# EAGLE schematic Schematic (EAGLE 9.7.0)
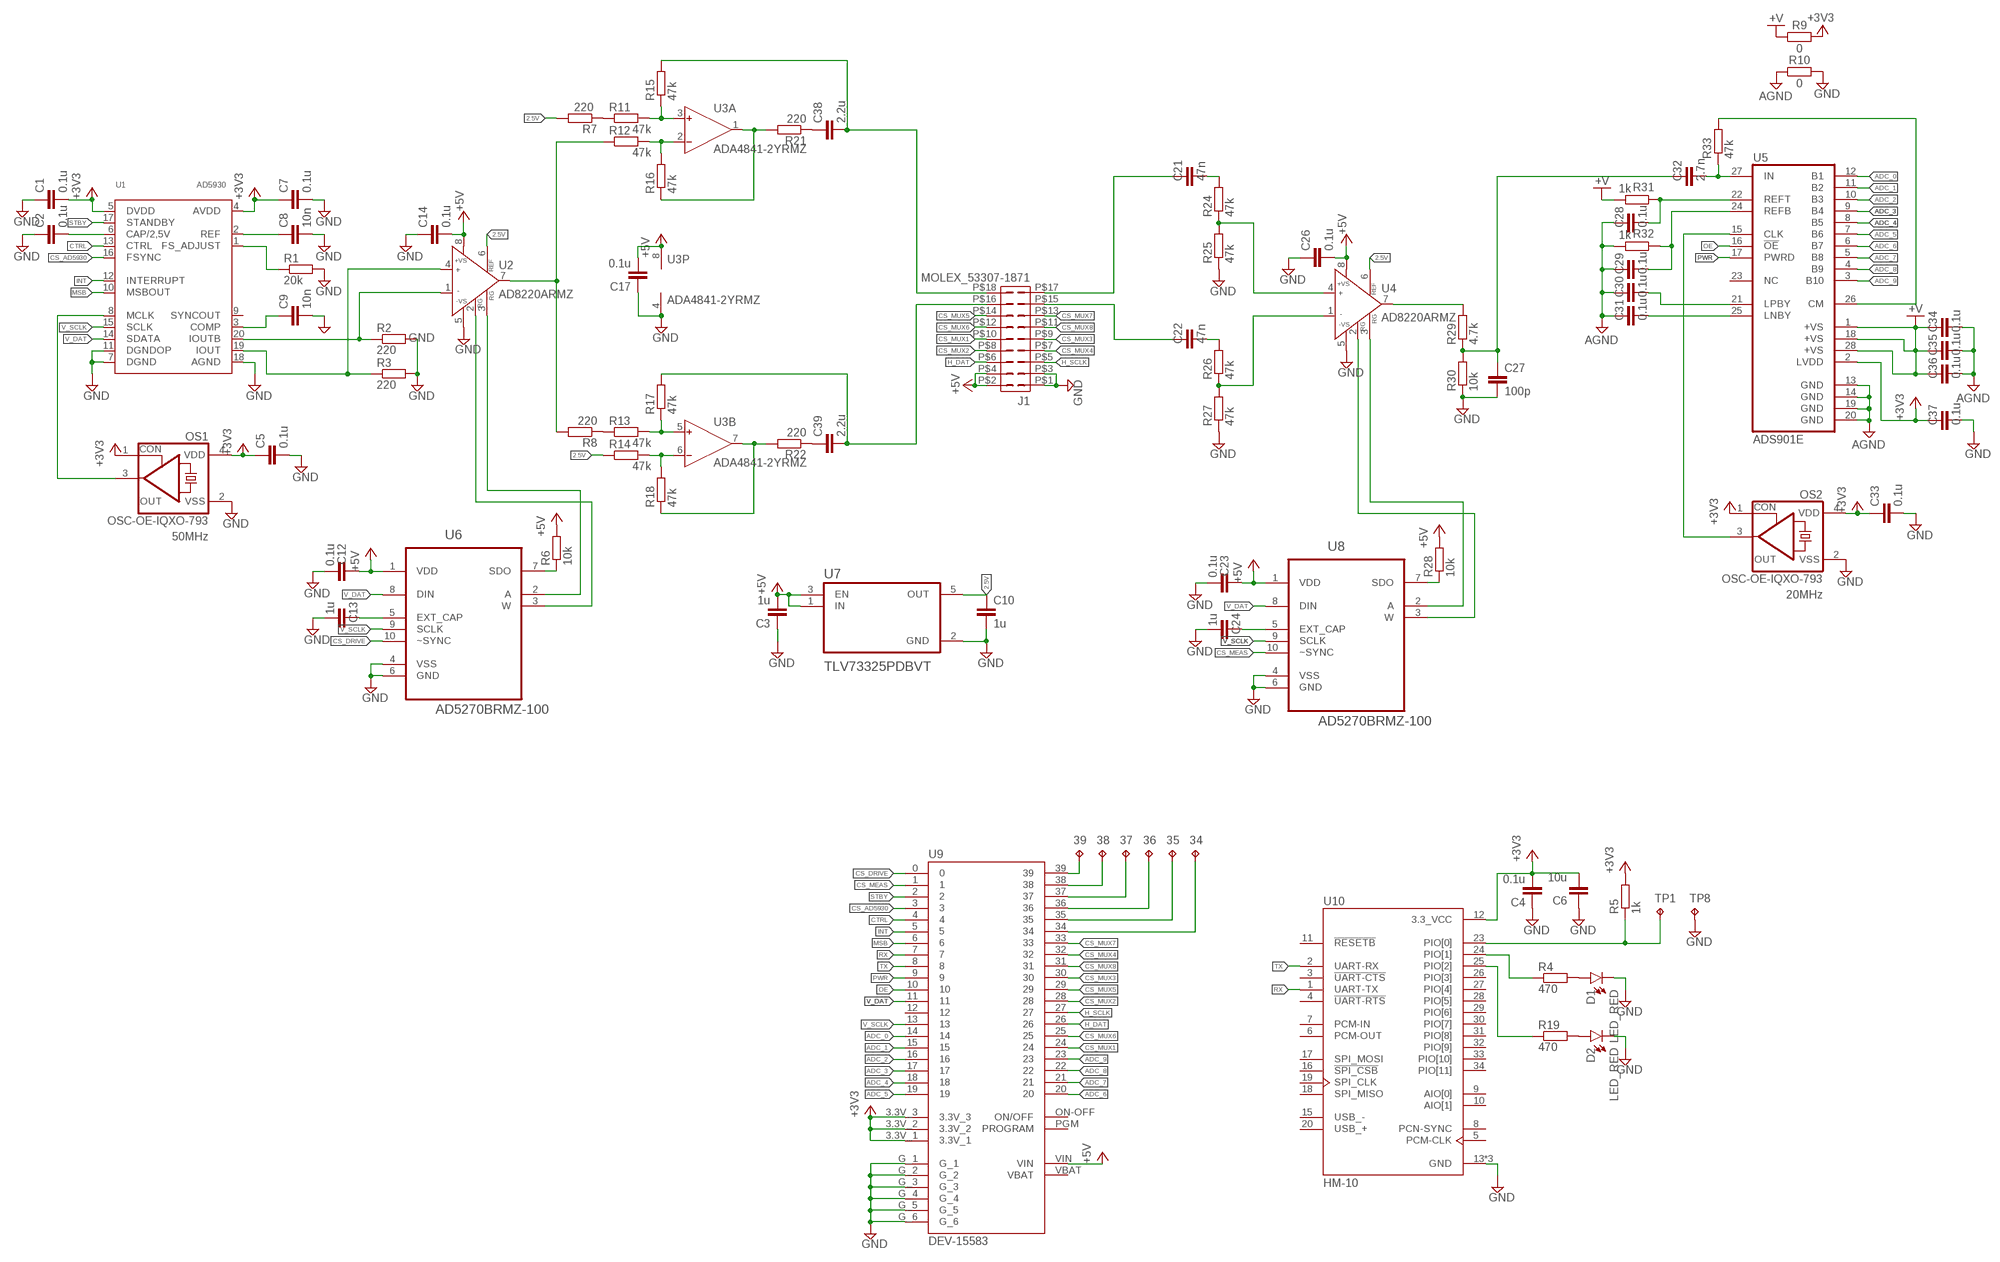
[diagram p0: schematic, sheet 1]

## Parts
34  TPTP13R  [TP13R]
35  TPTP13R  [TP13R]
36  TPTP13R  [TP13R]
37  TPTP13R  [TP13R]
38  TPTP13R  [TP13R]
39  TPTP13R  [TP13R]
C1  0.1u  C-EUC0603  [C0603]
C2  0.1u  C-EUC0603  [C0603]
C3  1u  C-EUC0603  [C0603]
C4  0.1u  C-EUC0603  [C0603]
C5  0.1u  C-EUC0603  [C0603]
C6  10u  C_CHIP-0805(2012-METRIC)  [CAPC2012X110]
C7  0.1u  C-EUC0603  [C0603]
C8  10n  C-EUC0603  [C0603]
C9  10n  C-EUC0603  [C0603]
C10  1u  C-EUC0603  [C0603]
C12  0.1u  C-EUC0603  [C0603]
C13  1u  C-EUC0603  [C0603]
C14  0.1u  C-EUC0603  [C0603]
C17  0.1u  C-EUC0603  [C0603]
C21  47n  C-EUC0603  [C0603]
C22  47n  C-EUC0603  [C0603]
C23  0.1u  C-EUC0603  [C0603]
C24  1u  C-EUC0603  [C0603]
C26  0.1u  C-EUC0603  [C0603]
C27  100p  C-EUC0603  [C0603]
C28  0.1u  C_CHIP-0402(1005-METRIC)  [CAPC1005X60]
C29  0.1u  C_CHIP-0402(1005-METRIC)  [CAPC1005X60]
C30  0.1u  C_CHIP-0402(1005-METRIC)  [CAPC1005X60]
C31  0.1u  C_CHIP-0402(1005-METRIC)  [CAPC1005X60]
C32  2.7n  C_CHIP-0402(1005-METRIC)  [CAPC1005X60]
C33  0.1u  C_CHIP-0402(1005-METRIC)  [CAPC1005X60]
C34  0.1u  C_CHIP-0402(1005-METRIC)  [CAPC1005X60]
C35  0.1u  C_CHIP-0402(1005-METRIC)  [CAPC1005X60]
C36  0.1u  C_CHIP-0402(1005-METRIC)  [CAPC1005X60]
C37  0.1u  C_CHIP-0402(1005-METRIC)  [CAPC1005X60]
C38  2.2u  C-EUC0603  [C0603]
C39  2.2u  C-EUC0603  [C0603]
D1  LED_RED  CHIP-ROUND-R_0603  [LEDC1608X65N_RND-R]
D2  LED_RED  CHIP-ROUND-R_0603  [LEDC1608X65N_RND-R]
J1  MOLEX_53307-1871  [MOLEX_53307-1871]
OS1  OSC-OE-IQXO-793  [2.5X2-4-PAD]
OS2  OSC-OE-IQXO-793  [2.5X2-4-PAD]
R1  20k  R-EU_R0603  [R0603]
R2  220  R-EU_R0603  [R0603]
R3  220  R-EU_R0603  [R0603]
R4  470  R-EU_R0603  [R0603]
R5  1k  R-EU_R0603  [R0603]
R6  10k  R-EU_R0603  [R0603]
R7  220  R-EU_R0603  [R0603]
R8  220  R-EU_R0603  [R0603]
R9  0  R_CHIP-0603(1608-METRIC)  [RESC1608X60]
R10  0  R_CHIP-0603(1608-METRIC)  [RESC1608X60]
R11  47k  R-EU_R0603  [R0603]
R12  47k  R-EU_R0603  [R0603]
R13  47k  R-EU_R0603  [R0603]
R14  47k  R-EU_R0603  [R0603]
R15  47k  R-EU_R0603  [R0603]
R16  47k  R-EU_R0603  [R0603]
R17  47k  R-EU_R0603  [R0603]
R18  47k  R-EU_R0603  [R0603]
R19  470  R-EU_R0603  [R0603]
R21  220  R-EU_R0603  [R0603]
R22  220  R-EU_R0603  [R0603]
R24  47k  R-EU_R0603  [R0603]
R25  47k  R-EU_R0603  [R0603]
R26  47k  R-EU_R0603  [R0603]
R27  47k  R-EU_R0603  [R0603]
R28  10k  R-EU_R0603  [R0603]
R29  4.7k  R-EU_R0603  [R0603]
R30  10k  R-EU_R0603  [R0603]
R31  1k  R_CHIP-0402(1005-METRIC)  [RESC1005X40]
R32  1k  R_CHIP-0402(1005-METRIC)  [RESC1005X40]
R33  47k  R_CHIP-0402(1005-METRIC)  [RESC1005X40]
TP1  TPTP20SQ  [TP20SQ]
TP8  TPTP20SQ  [TP20SQ]
U1  AD5930  [TSSOP20]
U2  AD8220ARMZ  [MSOP8]
U3  ADA4841-2YRMZ  [MSOP8]
U4  AD8220ARMZ  [MSOP8]
U5  ADS901E  [SSOP28BU]
U6  AD5270BRMZ-100  [SOP50P490X110-10N]
U7  TLV73325PDBVT  [SOT95P280X145-5N]
U8  AD5270BRMZ-100  [SOP50P490X110-10N]
U9  DEV-15583  [MODULE_DEV-15583]
U10  HM-10  [HM-10]

## Nets
2.5V: C10.1 R7.2 R14.1 U2.6(REF) U4.6(REF) U7.5(OUT)
+3V3 [Pour]: C1.2 C4.2 C5.1 C6.2 C7.1 C33.1 C37.1 OS1.1(CON) OS1.4(VDD) OS2.1(CON) OS2.4(VDD) R5.2 R9.2 U1.4(AVDD) U1.5(DVDD) U5.2(LVDD) U9.3.3V_1 U9.3.3V_2 U9.3.3V_3 U10.12(3.3_VCC)
+5V [Pour]: C3.2 C12.1 C14.2 C17.2 C23.1 C26.2 J1.P$2 J1.P$4 R6.2 R28.2 U2.8(+VS) U3.8(P:V+) U4.8(+VS) U6.1(VDD) U7.1(IN) U7.3(EN) U8.1(VDD) U9.VIN
+V: C34.1 C35.1 C36.1 R9.1 R31.2 U5.1(+VS) U5.18(+VS) U5.28(+VS)
ADC_0: U5.12(B1) U9.14
ADC_1: U5.11(B2) U9.15
ADC_2: U5.10(B3) U9.16
ADC_3: U5.9(B4) U9.17
ADC_4: U5.8(B5) U9.18
ADC_5: U5.7(B6) U9.19
ADC_6: U5.6(B7) U9.20
ADC_7: U5.5(B8) U9.21
ADC_8: U5.4(B9) U9.22
ADC_9: U5.3(B10) U9.23
AGND: C28.1 C29.1 C30.1 C31.1 C34.2 C35.2 C36.2 R10.1 R32.2 U5.13(GND) U5.14(GND) U5.19(GND) U5.20(GND)
CS_AD5930: U1.16(FSYNC) U9.3
CS_DRIVE: U6.10(~SYNC) U9.0
CS_MEAS: U8.10(~SYNC) U9.1
CS_MUX1: J1.P$10 U9.24
CS_MUX2: J1.P$8 U9.28
CS_MUX3: J1.P$9 U9.30
CS_MUX4: J1.P$7 U9.32
CS_MUX5: J1.P$14 U9.29
CS_MUX6: J1.P$12 U9.25
CS_MUX7: J1.P$13 U9.33
CS_MUX8: J1.P$11 U9.31
CTRL: U1.13(CTRL) U9.4
GND [Pour]: C1.1 C2.1 C3.1 C4.1 C5.2 C6.1 C7.2 C8.2 C9.2 C10.2 C12.2 C13.2 C14.1 C17.1 C23.2 C24.2 C26.1 C27.2 C33.2 C37.2 D1.C D2.C J1.P$1 J1.P$3 OS1.2(VSS) OS2.2(VSS) R1.2 R2.2 R3.2 R10.2 R25.1 R27.1 R30.1 TP8.TP U1.7(DGND) U1.11(DGNDOP) U1.18(AGND) U2.5(-VS) U3.4(P:V-) U4.5(-VS) U6.4(VSS) U6.6(GND) U7.2(GND) U8.4(VSS) U8.6(GND) U9.G_1 U9.G_2 U9.G_3 U9.G_4 U9.G_5 U9.G_6 U10.13(GND) U10.21(GND) U10.22(GND)
H_DAT: J1.P$6 U9.26
H_SCLK: J1.P$5 U9.27
INT: U1.12(INTERRUPT) U9.5
MSB: U1.10(MSBOUT) U9.6
N$1: R1.1 U1.1(FS_ADJUST)
N$2: C8.1 U1.2(REF)
N$3: C9.1 U1.3(COMP)
N$4: R2.1 U1.20(IOUTB) U2.1(IN-)
N$5: R3.1 U1.19(IOUT) U2.4(IN+)
N$6: R7.1 R11.1
N$7: R8.1 R13.1
N$8: R14.2 R18.2 U3.6(B:IN-)
N$9: R13.2 R17.1 U3.5(B:IN+)
N$10: R11.2 R15.1 U3.3(A:IN+)
N$11: R12.2 R16.2 U3.2(A:IN-)
N$12: R16.1 R21.2 U3.1(A:OUT)
N$13: OS1.3(OUT) U1.8(MCLK)
N$14: C2.2 U1.6(CAP/2,5V)
N$15: R18.1 R22.2 U3.7(B:OUT)
N$16: R6.1 U6.7(SDO)
N$17: C22.1 J1.P$15
N$18: C21.1 J1.P$17
N$19: U2.2(RG) U6.3(W)
N$20: R8.2 R12.1 U2.7(OUT)
N$21: U2.3(RG) U6.2(A)
N$22: C13.1 U6.5(EXT_CAP)
N$23: R28.1 U8.7(SDO)
N$24: R33.2 U5.26(CM)
N$25: C32.2 R33.1 U5.27(IN)
N$26: C24.1 U8.5(EXT_CAP)
N$27: C28.2 R31.1 U5.22(REFT)
N$28: C29.2 R32.1 U5.24(REFB)
N$29: C31.2 U5.25(LNBY)
N$30: C30.2 U5.21(LPBY)
N$31: U4.2(RG) U8.3(W)
N$32: OS2.3(OUT) U5.15(CLK)
N$33: R29.2 U4.7(OUT)
N$34: C21.2 R24.2
N$35: R24.1 R25.2 U4.4(IN+)
N$36: R26.1 R27.2 U4.1(IN-)
N$37: C22.2 R26.2
N$38: C38.2 J1.P$18 R15.2
N$39: U4.3(RG) U8.2(A)
N$40: C27.1 C32.1 R29.1 R30.2
N$41: D1.A R4.2
N$42: R5.1 TP1.TP U10.23(PIO[0])
N$43: R4.1 U10.24(PIO[1])
N$44: D2.A R19.2
N$45: R19.1 U10.25(PIO[2])
N$46: 39.TP U9.39
N$47: 38.TP U9.38
N$48: 37.TP U9.37
N$49: 36.TP U9.36
N$50: 35.TP U9.35
N$51: 34.TP U9.34
N$84: C39.2 J1.P$16 R17.2
N$85: C38.1 R21.1
N$86: C39.1 R22.1
OE: U5.16(!OE) U9.10
PWR: U5.17(PWRD) U9.9
RX: U9.7 U10.1(UART-TX)
STBY: U1.17(STANDBY) U9.2
TX: U9.8 U10.2(UART-RX)
V_DAT: U1.14(SDATA) U6.8(DIN) U8.8(DIN) U9.11
V_SCLK: U1.15(SCLK) U6.9(SCLK) U8.9(SCLK) U9.13
Unconnected: U1.9(SYNCOUT) U5.23(NC) U9.12 U9.ON-OFF(ON/OFF) U9.PGM(PROGRAM) U10.3(!UART-CTS) U10.4(!UART-RTS) U10.5(PCM-CLK) U10.6(PCM-OUT) U10.7(PCM-IN) U10.8(PCN-SYNC) U10.9(AIO[0]) U10.10(AIO[1]) U10.11(!RESETB) U10.15(USB_-) U10.16(!SPI_CSB) U10.17(SPI_MOSI) U10.18(SPI_MISO) U10.19(SPI_CLK) U10.20(USB_+) U10.26(PIO[3]) U10.27(PIO[4]) U10.28(PIO[5]) U10.29(PIO[6]) U10.30(PIO[7]) U10.31(PIO[8]) U10.32(PIO[9]) U10.33(PIO[10]) U10.34(PIO[11])

## Notes on the sheet
- 50MHz
- 20MHz

## Power pins joined to a net without a drawn wire
VBAT: U9.VBAT

## Library data of the parts
34-39 TP1 TP8 = testpad:TP: Test pad
C1-C5 C7-C10 C12-C14 C17 C21-C24 C26 C27 C38 C39 = rcl:C-EU: CAPACITOR, European symbol; SPICEPREFIX: C
C6 C28-C37 = Capacitor:C: Capacitor - Generic; CATEGORY: Capacitor
D1 D2 = LED:CHIP-ROUND-R: LED - Generic; CATEGORY: LED; COLOR: RED; DESCRIPTION: CHIP LED ROUND; SUB-CATEGORY: CHIP; TYPE: ROUND_TOP
J1 = Molex 53307-1871:MOLEX_53307-1871
OS1 OS2 = IQD-Frequency-Products:OSC-OE: OSCILLATOR WITH OE
R1-R8 R11-R19 R21 R22 R24-R30 = rcl:R-EU_: RESISTOR, European symbol; SPICEPREFIX: R
R9 R10 R31-R33 = Resistor:R: Resistor Fixed - Generic; CATEGORY: Resistor; SUB-CATEGORY: Fixed
U1 = AD5930:AD5930: Programmable Waveform Generator Output up to 25MHz Serial Interface Check prices <https://pricing.snapeda.com/parts/AD5930/Analog%20Devices/view-part?ref=eda>; AVAILABILITY: In Stock; DESCRIPTION: Direct Digital Synthesis IC 10 b 50MHz 24 b Tuning 20-TSSOP; MF: Analog Devices; MP: AD5930; PACKAGE: TSSOP-20 Analog Devices; PRICE: None
U2 U4 = ESP32_EIT:AD8220: Single-Supply, Rail-to-Rail, Low Power, FET Input Op Amp Source: http://www.analog.com/static/imported-files/data_sheets/AD820.pdf
U3 = ESP32_EIT:ADA4841-2: Ultralow Noise Amplifier at Lower Power Source: http://www.analog.com/static/imported-files/data_sheets/ADA4075-2.pdf
U5 = burr-brown:ADS901: 10-Bit, 20 MSPS ADC SE/Diff Inputs Ext Reference and Adjustable Fullscale Range; MF: TEXAS INSTRUMENT CONNECTORS; MPN: ADS901E; OC_FARNELL: 1509526; OC_NEWARK: 35C1591
U6 U8 = AD5270BRMZ-100:AD5270BRMZ-100: 1024-/256-Position, 1% Resistor Tolerance Error, SPI Interface and 50-TP Memory Digital Rheostat Check prices <https://pricing.snapeda.com/parts/AD5270BRMZ-100/Analog%20Devices/view-part?ref=eda>; AVAILABILITY: In Stock; DESCRIPTION: Digital Potentiometer 100k Ohm 1 Circuit 1024 Taps SPI Interface 10-MSOP; MF: Analog Devices; MP: AD5270BRMZ-100; PACKAGE: MSOP-10 Analog Devices; PRICE: None
U7 = TLV73325PDBVT:TLV73325PDBVT: Check prices <https://pricing.snapeda.com/parts/TLV73325PDBVT/Texas%20Instruments/view-part?ref=eda>; AVAILABILITY: In Stock; DESCRIPTION: 300-mA, capacitor-free, low-IQ, low-dropout voltage regulator with enable 5-SOT-23 -40 to 125; MF: Texas Instruments; MP: TLV73325PDBVT; PACKAGE: SOT-23-5 Texas Instruments; PRICE: None; PURCHASE-URL: https://pricing.snapeda.com/search/part/TLV73325PDBVT/?ref=eda
U9 = DEV_15583:DEV-15583: RT1062 Teensy 4.0 i.MX ARM® Cortex®-M7 MPU Embedded Evaluation Board Check prices <https://pricing.snapeda.com/parts/DEV-15583/SparkFun%20Electronics/view-part?ref=eda>; AVAILABILITY: In Stock; DESCRIPTION: RT1062 Teensy 4.0 i.MX ARM® Cortex®-M7 MPU Embedded Evaluation Board; MF: SparkFun Electronics; MP: DEV-15583; PACKAGE: None; PRICE: None; PURCHASE-URL: https://pricing.snapeda.com/search/part/DEV-15583/?ref=eda
U10 = HM-10:HM-10: Bluetooth to Serial Port Module Check prices <https://pricing.snapeda.com/parts/HC-05/ITead%20Studio/view-part?ref=eda>; AVAILABILITY: No availability data; DESCRIPTION: Bluetooth to Serial Port Module; MF: ITead Studio; MP: HC-05; PACKAGE: Module ITead Studio; PRICE: None